# EAGLE schematic spiceconvert (EAGLE 8.4.0)
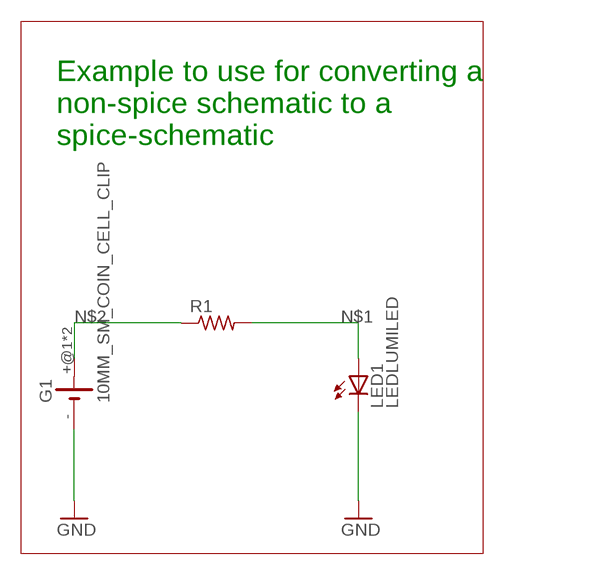
[diagram p0: schematic, sheet 1]

## Parts
G1  10MM_SM_COIN_CELL_CLIP  [10MM_SM_COIN_CELL_CLIP]
LED1  LEDLUMILED  [LUMILED]
R1  R-US_0207/10  [0207/10]

## Nets
GND: G1.- LED1.4-(C)
N$1: LED1.2+(A) R1.2
N$2: G1.+@1(+) G1.+@2(+) R1.1

## Notes on the sheet
- Example to use for converting a 
  non-spice schematic to a 
  spice-schematic

## Library data of the parts
G1 = battery:10MM_SM_COIN_CELL_CLIP: Battery cell clip for CR927 Source: KEYSTONE ELECTRONICS CORP. www.keyelco.com, ASTORIA, N.Y. 11105-2017 PART ANME 10mm SM COIN CELl CLIP DWG NO. 3030
LED1 = led-lumiled:LED: LED - LUMILED® LXK2-PW12-R00, LXK2-PW12-S00, LXK2-PW14-U00, LXK2-PW14-V00 LXK2-PM12-R00, LXK2-PM12-S00, LXK2-PM14-U00 LXK2-PE12-Q00, LXK2-PE12-R00, LXK2-PE12-S00, LXK2-PE14-T00, LXK2-PE14-U00 LXK2-PB12-K00, LXK2-PB12-L00, LXK2-PB12-M00, LXK2-PB14-N00, LXK2-PB14-P00, LXK2-PB14-Q00 LXK2-PR12-L00, LXK2-PR12-M00, LXK2-PR14-Q00, LXK2-PR14-R00 LXK2-PD12-Q00, LXK2-PD12-R00, LXK2-PD12-S00 LXK2-PH12-R00, LXK2-PH12-S00 LXK2-PL12-P00, LXK2-PL12-Q00, LXK2-PL12-R00 Source: www.luxeon.com; OC_FARNELL: unknown; OC_NEWARK: unknown
R1 = resistor:R-US_: RESISTOR, American symbol